# EasyEDA schematic 嘉立创EDA_ESP32无人机_2024-11-06.json
TITLE: four-rotor; REV: 1.0; Date: 2024-10-20; Sheet: 1/1; Drawn By: 张朋洋; Company: 暨南大学

## Parts
1  BAT
2  SW-SPDT
3  100K
4  73.2K
5  4.7uH,4A
6  22uF
7  22uF
8  15pF
C4  1UF  [C 0402]
C5  1UF  [C 0402]
C18  2.2nF  [C 0402]
C19  10nF  [C 0402]
C20  0.1uF  [C 0402]
C21  0.1uF  [C 0402]
C22  0.1uF  [C 0402]
C23  10pF  [C 0402]
C24  10pF  [C 0402]
C25  2.2nF  [C 0402]
C26  4.7pF  [C 0402]
C27  1nF  [C 0402]
C28  1.5nF  [C 0402]
C29  33nF  [C 0402]
C30  1nF  [C 0402]
C31  10nF  [C 0402]
C32  22uF  [C  0603]
D10  1N5819W  [R-SOD 123]
E1  ANT  [R-ANT]
L2  2.7nH  [R 0402]
L3  8.2nH  [R 0402]
L4  3.9nH  [R 0402]
LED1  WS2812B-MINI  [WS2812B- MINI]
LED2  WS2812B-MINI  [WS2812B- MINI]
LED3  WS2812B-MINI  [WS2812B- MINI]
LED4  WS2812B-MINI  [WS2812B- MINI]
MK?#2  NRF24L01
OSCO  XTAL16MHZ  [SMD-3225 4P]
R15  4.7K  [R 0402]
R16  4.7K  [R 0402]
R17  0R  [R 0603]
R18  22K  [R 0402]
R19  15R  [R 0603]
U1  SX1308  [SOT23-6]
U2  ME6206A33M3G  [R-SOT-23]
U3  MPU6050  [R-QFN 24]
U4  SPL06-001  [SENSOR-SMD SPL06-001]
U6  NRF24L01-P  [R-QFN20]
U?#1  OV2640 CAMERA BOARD
U?#2  ESP32-WROOM-32E-N4  [WIFI-SMD_ESP32-WROOM-32E-A]
U?#3  BD6221F-E2
U?#3  BD6221F-E2  [SOP-8_L4.9-W3.9-P1.27-LS6.0-BL]
U?#4  BD6221F-E2
U?#4  BD6221F-E2  [SOP-8_L4.9-W3.9-P1.27-LS6.0-BL]
U?#5  BD6221F-E2
U?#5  BD6221F-E2  [SOP-8_L4.9-W3.9-P1.27-LS6.0-BL]
U?#6  ESP32-WROOM-32E-N4
U?#6  OV2640 CAMERA BOARD  [SENSORM-TH_L35.7-W3.9-OV2640]
U?#7  BD6221F-E2
U?#7  L76L-M33  [COMM-SMD_18P-L10.1-W9.7-P1.1-TL_L76-LB]
U?#8  L76L-M33

## Library data of the parts
1 = D-BAT
2 = D-SW-SPDT
3 = D-R 0402_1
4 = D-R 0402_2
5 = D-I 1812
6 = D-C 0603
7 = D-C 0603_1
8 = D-C 0402
C4 C5 = C 0603: Contributor: PQG2030PQG; Manufacturer Part: FS18B105K160PBG; Supplier: LCSC; Manufacturer: Prosperity Dielectrics; Supplier Part: C328910
C18 = C 0603: Contributor: PQG2030PQG; Manufacturer Part: 0603B222K500NT; Supplier: LCSC; Manufacturer: FH; Supplier Part: C1604
C19 = C 0603: Contributor: PQG2030PQG; Manufacturer Part: 0603B103J500; Supplier: LCSC; Manufacturer: WTC; Supplier Part: C128615
C20-C22 = C 0603: Contributor: PQG2030PQG; Manufacturer Part: TCC0603X7R104K500CT; Supplier: LCSC; Manufacturer: CCTC; Supplier Part: C282519
C23-C31 = C 0402: Supplier: LCSC; Contributor: PQG2030PQG
C32 = C 0603: Contributor: PQG2030PQG
D10 = R-1N5819W: Supplier: LCSC; Supplier Part: C169540; Manufacturer: Shandong Jingdao Microelectronics; Contributor: PQG2030PQG; LCSC Assembly: Yes; SMT Type: Extend
E1 = R-ANT: Contributor: PQG2030PQG
L2-L4 = R-L 0603: Contributor: PQG2030PQG
LED1-LED4 = WS2812B-MINI: Supplier: LCSC; Manufacturer: Worldsemi; Contributor: PQG2030PQG; Supplier Part: C473063
MK?#2 = NRF24L01: Manufacturer Part: NF-04; Manufacturer: Ai-Thinker(安信可); Supplier Part: C90751; Supplier: LCSC
OSCO = XTAL16MHZ: Contributor: 酷电玩家
R15 R16 = R 0603: Contributor: PQG2030PQG; Manufacturer Part: RS-03K4701FT; Supplier: LCSC; Manufacturer: FH; Supplier Part: C116693
R17-R19 = R 0402: Supplier: LCSC; Supplier Part: C303816; Manufacturer: SOCAY Elec; Manufacturer Part: SC0402E050M05; Contributor: PQG2030PQG
U1 = SX1308: sourceId: g4Yg9rJ1j; Supplier: LCSC; Manufacturer: SX; Supplier Part: C78162; JLCPCB Part Class: Extended Part; Contributor: 酷电玩家
U2 = R-XC6206: Contributor: PQG2030PQG; Supplier: LCSC; Manufacturer: MICRONE; Supplier Part: C35259
U3 = R-MPU6050-2: Mounted: No; Supplier Part: C24112; Supplier: LCSC; Contributor: PQG2030PQG; Manufacturer Part: MPU-6050; Manufacturer: InvenSense
U4 = SPL06-001: Supplier: LCSC; Supplier Part: C2684428; Manufacturer: Goertek(歌尔); Contributor: 酷电玩家; JLCPCB Part Class: Extended Part
U6 = R-NRF24L01: Supplier: LCSC; Manufacturer: NORDIC; Manufacturer Part: NRF24L01; Supplier Part: C93664; LCSC Assembly: Yes; SMT Type: Extend; Contributor: PQG2030PQG
U?#1 = OV2640 CAMERA BOARD: Manufacturer Part: OV2640 Camera Board; Manufacturer: Waveshare(微雪电子); Supplier Part: C359962; Supplier: LCSC
U?#2 = ESP32-WROOM-32E-N4: Contributor: lcsc; Supplier: LCSC; Supplier Part: C2973652; Manufacturer: ESPRESSIF(乐鑫); Manufacturer Part: ESP32-WROOM-32E; JLCPCB Part Class: Extended Part
U?#3 = BD6221F-E2_2: Manufacturer: ROHM(罗姆); Supplier Part: C79612; Supplier: LCSC
U?#3-U?#5 = BD6221F-E2: Supplier: LCSC; Manufacturer: ROHM(罗姆); Supplier Part: C79612; JLCPCB Part Class: Extended Part
U?#4 = BD6221F-E2: Manufacturer: ROHM(罗姆); Supplier Part: C79612; Supplier: LCSC
U?#5 = BD6221F-E2_1: Manufacturer: ROHM(罗姆); Supplier Part: C79612; Supplier: LCSC
U?#6 = ESP32-WROOM-32E-N4: Manufacturer Part: ESP32-WROOM-32E; Manufacturer: ESPRESSIF(乐鑫); Supplier Part: C2973652; Supplier: LCSC
U?#6 = OV2640 CAMERA BOARD: Supplier: LCSC; Supplier Part: C359962; Manufacturer: Waveshare(微雪电子); Manufacturer Part: OV2640 Camera Board; Contributor: lcsc; JLCPCB Part Class: Extended Part
U?#7 = BD6221F-E2_3: Manufacturer: ROHM(罗姆); Supplier Part: C79612; Supplier: LCSC
U?#7 = L76L-M33: Supplier: LCSC; Supplier Part: C2916232; Manufacturer: Quectel(移远); JLCPCB Part Class: Extended Part; Contributor: lcsc
U?#8 = L76L-M33: Manufacturer: Quectel(移远); Supplier Part: C2916232; Supplier: LCSC

## Nets
3V3: C5.1 C21.2 R15.2 R16.2 R19.1 U2.2(OUT) U3.13(VDD)
3v3: C19.1 C22.1 U3.8(VLOGIC) U4.2(CSB) U4.6(VDDIO) U4.8(VDD)
5V: 4.1 7.2 8.1 C4.1 D10.2 LED1.1(VDD) LED2.1(VDD) LED3.1(VDD) LED4.1(VDD) U2.3(IN)
GND: 6.2 7.1 C4.2 C5.2 C18.2 C19.2 C20.2 C21.1 C22.2 LED1.3(VSS) LED2.3(VSS) LED3.3(VSS) LED4.3(VSS) R17.1 U1.2(GND) U2.1(GND) U3.1(CLKIN) U3.9(AD0) U3.11(FSYNC) U3.18(GND) U4.1(GND) U4.5(SDO) U4.7(GND)
VBAT: 1.1 2.2
VBAT-OUT: 2.3 3.2 5.1 6.1 U1.5(VIN)
INT: U3.12(INT)
RF-3V3: C30.1 C31.1 C32.2 R19.2 U6.7(VDD1) U6.15(VDD2) U6.18(VDD3)
RF-CE: U6.1(CE)
RF-CSN: U6.2(CSN)
RF-GND: C23.1 C24.1 C25.1 C26.1 C27.1 C29.2 C30.2 C31.2 C32.1 R17.2 R18.2 U6.8(VSS1) U6.14(VSS2) U6.17(VSS3) U6.20(VSS4) U6.NC
RF-IRQ: U6.6(IRQ)
RF-MISO: U6.5(MISO)
RF-MOSI: U6.4(MOSI)
RF-SCK: U6.3(SCK)
RGBLED: LED1.4(DIN)
SCL: R15.1 U3.23(SCL) U4.4(SCK)
SDA: R16.1 U3.24(SDA) U4.3(SDA)
Net-(C27-Pad2): C27.2 C28.1 E1.1
Net-(C28-Pad2): C28.2 L4.2
Net-(LED1-DOUT): LED1.2(DOUT) LED2.4(DIN)
Net-(LED2-DOUT): LED2.2(DOUT) LED3.4(DIN)
Net-(LED3-DOUT): LED3.2(DOUT) LED4.4(DIN)
Net-(OSCO-OSCI): C23.2 OSCO.3(OSCI) U6.10(XC1)
Net-(OSCO-OSCO): C24.2 OSCO.1(OSCO) U6.9(XC2)
Net-(U1-EN): 3.1 U1.4(EN)
Net-(U1-FB): 1.2 4.2 8.2 U1.3(FB)
Net-(U1-SW): 5.2 D10.1 U1.1(SW)
Net-(U3-CPOUT): C18.1 U3.20(CPOUT)
Net-(U3-REGOUT): C20.1 U3.10(REGOUT)
Net-(U6-ANT1): L2.1 L3.1 U6.12(ANT1)
Net-(U6-ANT2): L3.2 L4.1 U6.13(ANT2)
Net-(U6-DVDD): C29.1 U6.19(DVDD)
Net-(U6-IREF): R18.1 U6.16(IREF)
Net-(U6-VDD-PA): C25.2 C26.2 L2.2 U6.11(VDD-PA)

Not connected (* = marked no-connect by the designer): 2 1*; LED4 2(DOUT)*; MK?#2 1(VCC) 2(GND) 3(CSN) 4(CE) 5(MOSI) 6(SCK) 7(IRQ) 8(MISO); OSCO 2(NC)* 4(NC)*; U1 6(NC)*; U3 2(NC)* 3(NC)* 4(NC)* 5(NC)* 6(A-DA)* 7(A-CL)* 14(NC)* 15(NC)* 16(NC)* 17(NC)* 19(RESV)* 21(RESV)* 22(CLKOUT)*; U?#1 1(3.3V) 2(SIOC) 3(VSYNK) 4(PCLK) 5(D9) 6(D7) 7(D5) 8(D3) 9(RET) 10(PWON) 11(D2) 12(D4) 13(D6) 14(D8) 15(XCLK) 16(HREF) 17(SIOD) 18(GND); U?#3 1(OUT1) 2(VCC) 3(VCC) 4(FIN) 5(RIN) 6(VREF) 7(OUT2) 8(GND); U?#4 1(OUT1) 2(VCC) 3(VCC) 4(FIN) 5(RIN) 6(VREF) 7(OUT2) 8(GND); U?#5 1(OUT1) 2(VCC) 3(VCC) 4(FIN) 5(RIN) 6(VREF) 7(OUT2) 8(GND); U?#6 1(GND) 2(3V3) 3(EN) 4(SENSOR_VP) 5(SENSOR_VN) 6(IO34) 7(IO35) 8(IO32) 9(IO33) 10(IO25) 11(IO26) 12(IO27) 13(IO14) 14(IO12) 15(GND) 16(IO13) 17(NC) 18(NC) 19(NC) 20(NC) 21(NC) 22(NC) 23(IO15) 24(IO2) 25(IO0) 26(IO4) 27(IO16) 28(IO17) 29(IO5) 30(IO18) 31(IO19) 32(NC) 33(IO21) 34(RXD0) 35(TXD0) 36(IO22) 37(IO23) 38(GND) 39(GND); U?#7 1(OUT1) 2(VCC) 3(VCC) 4(FIN) 5(RIN) 6(VREF) 7(OUT2) 8(GND); U?#8 1(GND) 2(TXD) 3(RXD) 4(1PPS) 5(STANDBY) 6(V_BCKP) 7(NC) 8(VCC) 9(RESET_N) 10(GND) 11(RF_IN) 12(GND) 13(ANTON) 14(VDD_RF) 15(NC) 16(RESERVED/I2C_SDA) 17(RESERVED/I2C_SCL) 18(WAKEUP)

## Notes on the sheet
- 电源供电
- 先升压然后降压-稳压模块
- 这是套用的，需要对这个改进下
- 一些LED模块，这个要求不高
- 核心芯片
- GPS定位模块
- 气压计模块
- 摄像头模块
- 陀螺仪模块
- 无线通讯模块
- 想换成这个封装
- 这是无刷电机驱动器，因为一般esp32的gpio口电压无法驱动电机
